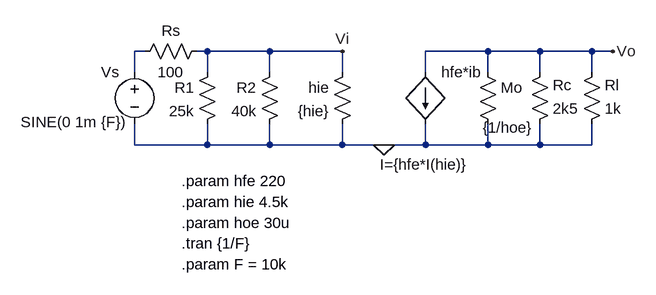
[diagram p0: schematic modelo hibrido.asc]
modelo hibrido.asc, the LTspice schematic file:
Version 4
SHEET 1 880 680
WIRE 64 96 48 96
WIRE 160 96 144 96
WIRE 256 96 160 96
WIRE 368 96 256 96
WIRE 592 96 496 96
WIRE 672 96 592 96
WIRE 752 96 672 96
WIRE 784 96 752 96
WIRE 48 128 48 96
WIRE 160 128 160 96
WIRE 256 128 256 96
WIRE 368 128 368 96
WIRE 496 128 496 96
WIRE 592 128 592 96
WIRE 672 128 672 96
WIRE 752 128 752 96
WIRE 48 240 48 208
WIRE 160 240 160 208
WIRE 160 240 48 240
WIRE 256 240 256 208
WIRE 256 240 160 240
WIRE 368 240 368 208
WIRE 368 240 256 240
WIRE 432 240 368 240
WIRE 496 240 496 208
WIRE 496 240 432 240
WIRE 592 240 592 208
WIRE 592 240 496 240
WIRE 672 240 672 208
WIRE 672 240 592 240
WIRE 752 240 752 208
WIRE 752 240 672 240
FLAG 784 96 Vo
FLAG 432 240 0
FLAG 368 96 Vi
SYMBOL voltage 48 112 M0
WINDOW 123 0 0 Left 0
WINDOW 39 0 0 Left 0
WINDOW 3 11 93 Left 2
SYMATTR InstName Vs
SYMATTR Value SINE(0 1m {F})
SYMBOL res 176 112 M0
SYMATTR InstName R1
SYMATTR Value 25k
SYMBOL res 272 112 M0
SYMATTR InstName R2
SYMATTR Value 40k
SYMBOL res 384 112 M0
SYMATTR InstName hie
SYMATTR Value {hie}
SYMBOL res 160 80 R90
WINDOW 0 0 56 VBottom 2
WINDOW 3 32 56 VTop 2
SYMATTR InstName Rs
SYMATTR Value 100
SYMBOL res 576 112 R0
WINDOW 3 8 101 Left 2
SYMATTR InstName Mo
SYMATTR Value {1/hoe}
SYMBOL res 656 224 M180
WINDOW 0 36 76 Left 2
WINDOW 3 36 40 Left 2
SYMATTR InstName Rc
SYMATTR Value 2k5
SYMBOL res 736 224 M180
WINDOW 0 36 76 Left 2
WINDOW 3 36 40 Left 2
SYMATTR InstName Rl
SYMATTR Value 1k
SYMBOL bi 496 128 R0
WINDOW 3 -70 142 Left 2
SYMATTR InstName hfe*ib
SYMATTR Value I={hfe*I(hie)}
TEXT 120 296 Left 2 !.param hfe 220
TEXT 120 328 Left 2 !.param hie 4.5k
TEXT 120 360 Left 2 !.param hoe 30u
TEXT 120 392 Left 2 !.tran {1/F}
TEXT 120 424 Left 2 !.param F = 10k

The netlist it stands for:
* modelo hibrido.asc
Vs N001 0 SINE(0 1m {F})
R1 Vi 0 25k
R2 Vi 0 40k
R§hie Vi 0 {hie}
Rs Vi N001 100
R§Mo Vo 0 {1/hoe}
Rc 0 Vo 2k5
Rl 0 Vo 1k
B§hfe*ib Vo 0 I={hfe*I(hie)}
.param hfe 220
.param hie 4.5k
.param hoe 30u
.tran {1/F}
.param F = 10k
.backanno
.end